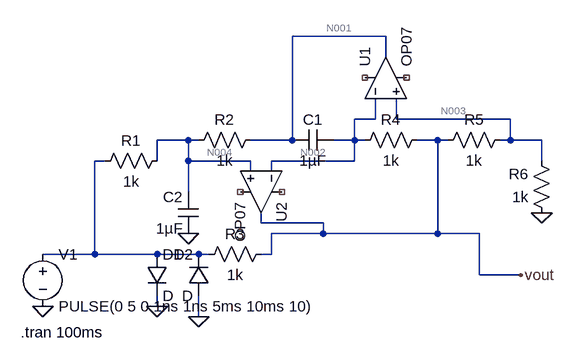
[diagram p0: schematic problem1.asc]
problem1.asc, the LTspice schematic file:
Version 4
SHEET 1 880 680
WIRE 256 -64 112 -64
WIRE 256 -32 256 -64
WIRE 240 64 240 32
WIRE 240 64 208 64
WIRE 272 64 272 32
WIRE 448 64 272 64
WIRE -48 96 -96 96
WIRE -32 96 -48 96
WIRE 112 96 112 -64
WIRE 112 96 48 96
WIRE 208 96 208 64
WIRE 208 96 176 96
WIRE 224 96 208 96
WIRE 336 96 304 96
WIRE 352 96 336 96
WIRE 448 96 448 64
WIRE 448 96 432 96
WIRE 496 96 448 96
WIRE -176 128 -192 128
WIRE -96 128 -96 96
WIRE -48 128 -48 96
WIRE 48 128 -48 128
WIRE 208 128 208 96
WIRE 208 128 80 128
WIRE 496 128 496 96
WIRE 48 144 48 128
WIRE 80 144 80 128
WIRE -48 176 -48 128
WIRE 64 224 64 208
WIRE 160 224 64 224
WIRE 160 240 160 224
WIRE 160 240 80 240
WIRE 336 240 336 96
WIRE 336 240 160 240
WIRE 400 240 336 240
WIRE -192 272 -192 128
WIRE -192 272 -272 272
WIRE -96 272 -192 272
WIRE -32 272 -96 272
WIRE -16 272 -32 272
WIRE 80 272 80 240
WIRE 80 272 64 272
WIRE 400 304 400 240
WIRE 464 304 400 304
WIRE -96 352 -96 336
WIRE -32 368 -32 336
FLAG -96 352 0
FLAG -32 368 0
FLAG -48 240 0
FLAG 496 208 0
FLAG -272 352 0
FLAG 464 304 vout
SYMBOL cap 176 80 R90
WINDOW 0 0 32 VBottom 2
WINDOW 3 32 32 VTop 2
SYMATTR InstName C1
SYMATTR Value 1µF
SYMBOL cap -32 240 R180
WINDOW 0 24 56 Left 2
WINDOW 3 24 8 Left 2
SYMATTR InstName C2
SYMATTR Value 1µF
SYMBOL Opamps\\OP07 128 176 R90
SYMATTR InstName U2
SYMBOL res -80 112 R90
WINDOW 0 0 56 VBottom 2
WINDOW 3 32 56 VTop 2
SYMATTR InstName R1
SYMATTR Value 1k
SYMBOL res 64 80 R90
WINDOW 0 0 56 VBottom 2
WINDOW 3 32 56 VTop 2
SYMATTR InstName R2
SYMATTR Value 1k
SYMBOL res 80 256 R90
WINDOW 0 0 56 VBottom 2
WINDOW 3 32 56 VTop 2
SYMATTR InstName R3
SYMATTR Value 1k
SYMBOL res 320 80 R90
WINDOW 0 0 56 VBottom 2
WINDOW 3 32 56 VTop 2
SYMATTR InstName R4
SYMATTR Value 1k
SYMBOL res 448 80 R90
WINDOW 0 0 56 VBottom 2
WINDOW 3 32 56 VTop 2
SYMATTR InstName R5
SYMATTR Value 1k
SYMBOL res 512 224 R180
WINDOW 0 36 76 Left 2
WINDOW 3 36 40 Left 2
SYMATTR InstName R6
SYMATTR Value 1k
SYMBOL diode -112 272 R0
SYMATTR InstName D1
SYMBOL diode -16 336 R180
WINDOW 0 24 64 Left 2
WINDOW 3 24 0 Left 2
SYMATTR InstName D2
SYMBOL Opamps\\OP07 192 0 R270
SYMATTR InstName U1
SYMBOL voltage -272 256 R0
WINDOW 123 0 0 Left 2
WINDOW 39 0 0 Left 2
SYMATTR InstName V1
SYMATTR Value PULSE(0 5 0 1ns 1ns 5ms 10ms 10)
TEXT -306 392 Left 2 !.tran 100ms

The netlist it stands for:
* problem1.asc
C1 N002 N001 1µF
C2 0 N004 1µF
XU2 N004 N002 NC_01 NC_02 vout LT1001  ; OP07, pins In+ In- V+ V- OUT
R1 N004 N005 1k
R2 N001 N004 1k
R3 vout N005 1k
R4 vout N002 1k
R5 N003 vout 1k
R6 0 N003 1k
D1 N005 0 D
D2 0 N005 D
XU1 N003 N002 NC_03 NC_04 N001 LT1001  ; OP07, pins In+ In- V+ V- OUT
V1 N005 0 PULSE(0 5 0 1ns 1ns 5ms 10ms 10)
.model D D
.lib standard.dio
.tran 100ms
.lib LTC.lib
.backanno
.end

* Results of the author's LTspice run, read from the files saved beside the schematic
* Operating Point, zero values left out:
*   V(n002) = 99.9 µV
*   V(n001) = 299.7 µV
*   V(n004) = 149.8 µV
*   V(vout) = 99.9 µV
*   V(n003) = 49.95 µV
*   I(R6) = -49.95 nA
*   I(R5) = -49.95 nA
*   I(R3) = 99.9 nA
*   I(R2) = 149.8 nA
*   I(R1) = 149.8 nA
*   I(V1) = 249.7 nA
*   Ix(u2:5) = -149.9 nA
*   Ix(u1:5) = -149.8 nA
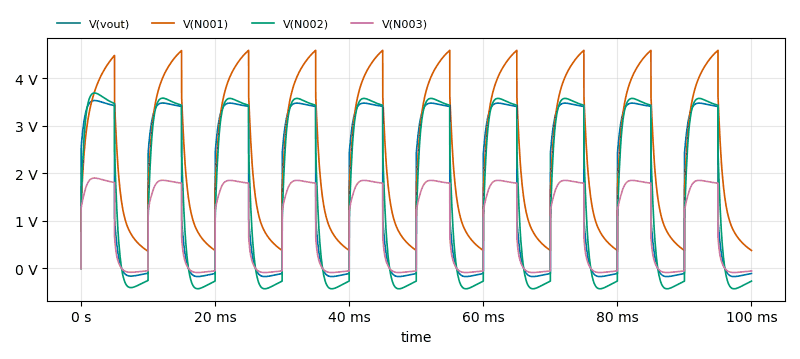
[diagram p1: Transient Analysis of problem1.asc, plotted from the saved traces]
* Transient Analysis, 1 run:
*   V(vout): min -171.2 mV, max 3.529 V, average 1.663 V, rms 2.384 V, last -106.7 mV
*   V(N001): min 299.7 µV, max 4.583 V, average 2.453 V, rms 2.92 V, last 377.6 mV
*   V(N002): min -428.2 mV, max 3.688 V, average 1.612 V, rms 2.403 V, last -266.9 mV
*   V(N003): min -85.62 mV, max 1.9 V, average 875.7 mV, rms 1.254 V, last -53.35 mV